# EAGLE schematic Displayboard_schematic (EAGLE 9.7.0)
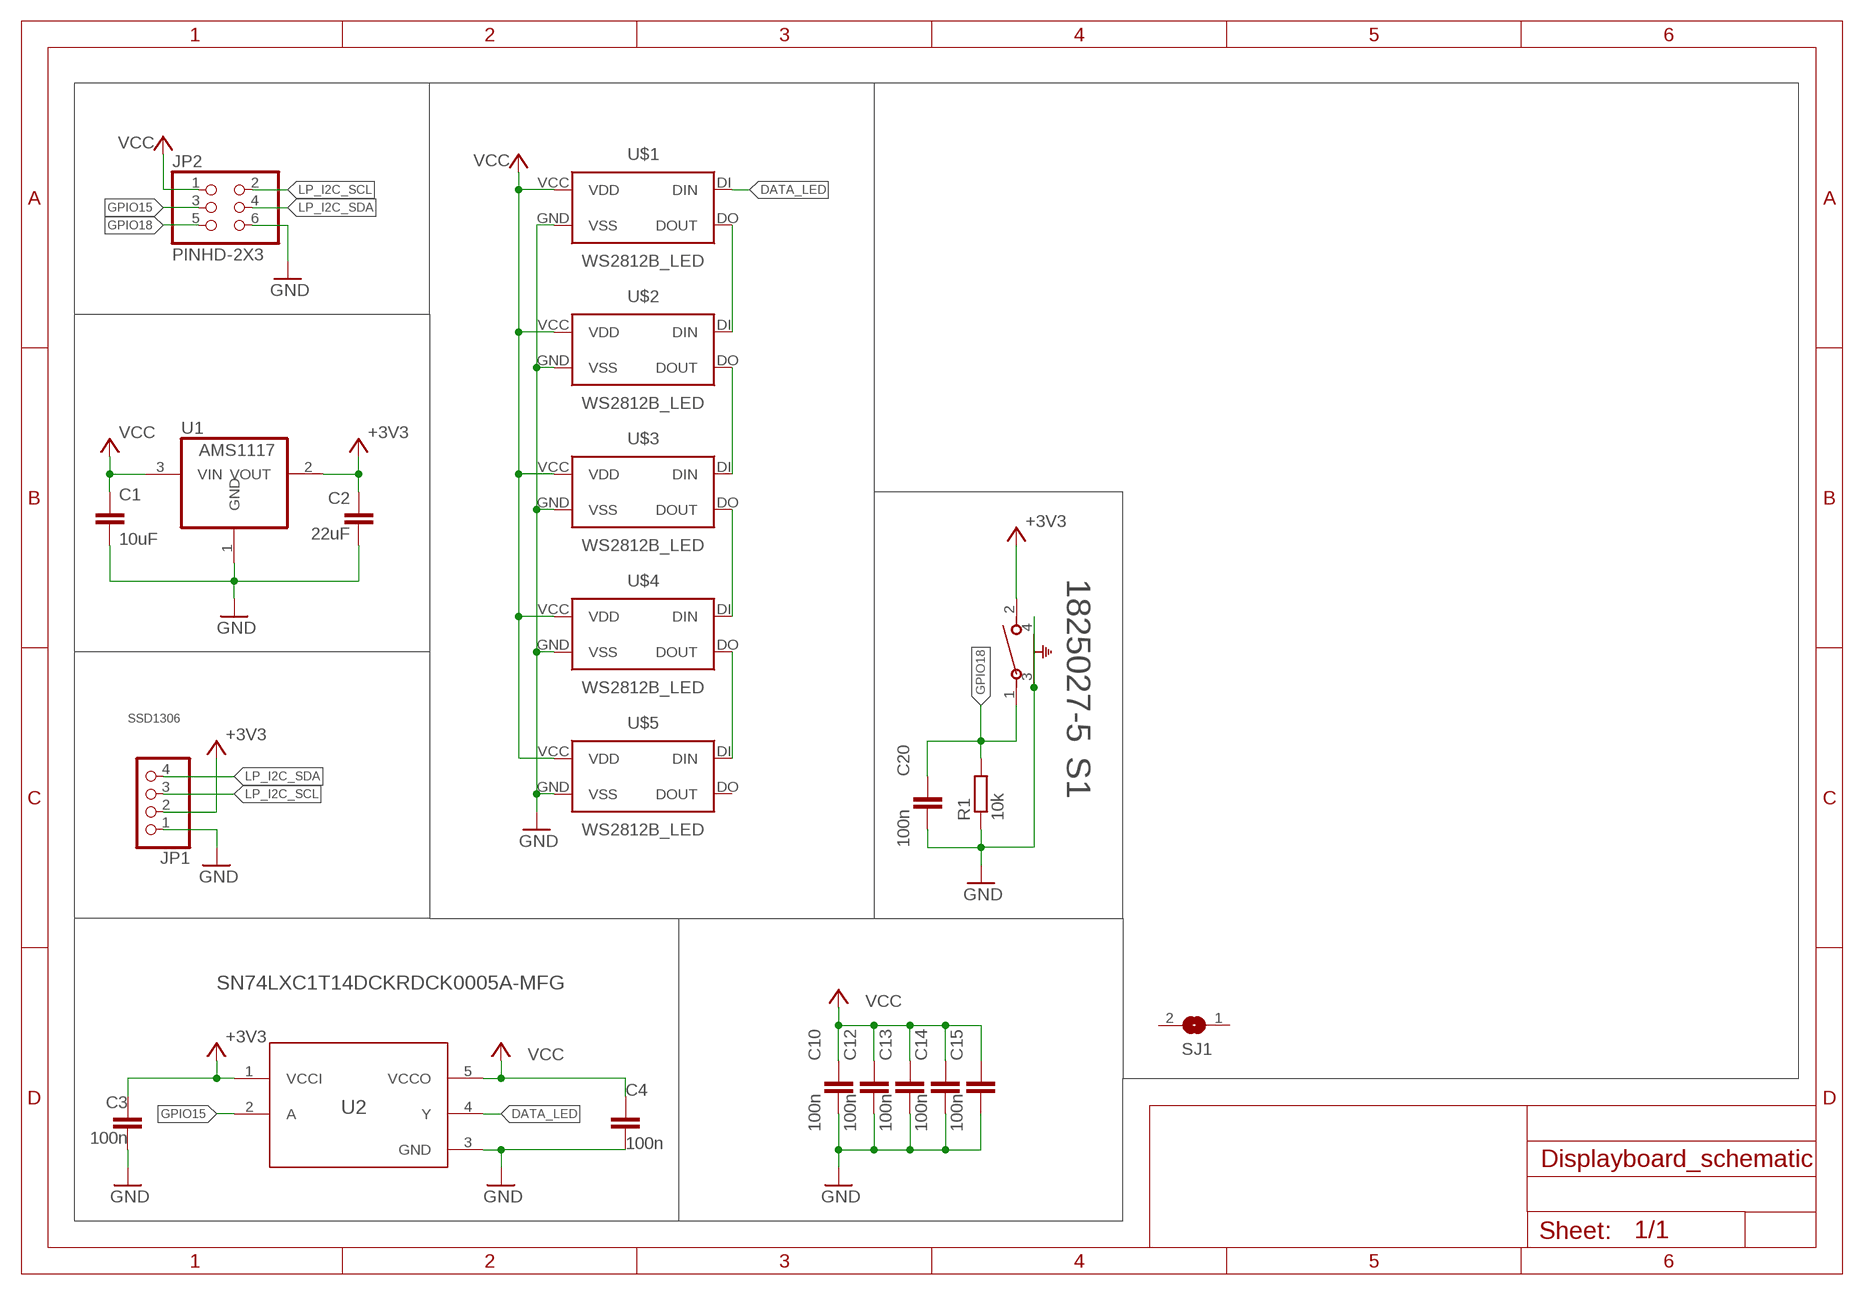
[diagram p0: schematic, sheet 1]

## Parts
C1  10uF  C-EUC0603  [C0603]
C2  22uF  C-EUC0603  [C0603]
C3  100n  C-EUC0603  [C0603]
C4  100n  C-EUC0603  [C0603]
C10  100n  C-EUC0603  [C0603]
C12  100n  C-EUC0603  [C0603]
C13  100n  C-EUC0603  [C0603]
C14  100n  C-EUC0603  [C0603]
C15  100n  C-EUC0603  [C0603]
C20  100n  C-EUC0603  [C0603]
JP1  PINHD-1X4  [1X04]
JP2  PINHD-2X3  [2X03]
R1  10k  R-EU_R0603  [R0603]
S1  1825027-5  [SW2_1825027-A]
SJ1  SJ  [SJ]
U1  AMS1117  LD1117  [SOT223]
U2  SN74LXC1T14DCKRDCK0005A-MFG  [DCK0005A-MFG]
U$1  WS2812B_LED  [WS2812_5050]
U$2  WS2812B_LED  [WS2812_5050]
U$3  WS2812B_LED  [WS2812_5050]
U$4  WS2812B_LED  [WS2812_5050]
U$5  WS2812B_LED  [WS2812_5050]

## Nets
+3V3: C2.1 C3.1 JP1.2 S1.2 U1.2(VOUT) U2.1(VCCI)
DATA_LED: U2.4(Y) U$1.DI(DIN)
GND: C1.2 C2.2 C3.2 C4.2 C10.2 C12.2 C13.2 C14.2 C15.2 C20.2 JP1.1 JP2.6 R1.1 S1.3 S1.4 U1.1(GND) U2.3(GND) U$1.GND(VSS) U$2.GND(VSS) U$3.GND(VSS) U$4.GND(VSS) U$5.GND(VSS)
GPIO15: JP2.3 U2.2(A)
GPIO18: C20.1 JP2.5 R1.2 S1.1
LP_I2C_SCL: JP1.3 JP2.2
LP_I2C_SDA: JP1.4 JP2.4
N$1: U$1.DO(DOUT) U$2.DI(DIN)
N$2: U$2.DO(DOUT) U$3.DI(DIN)
N$3: U$3.DO(DOUT) U$4.DI(DIN)
N$4: U$4.DO(DOUT) U$5.DI(DIN)
VCC: C1.1 C4.1 C10.1 C12.1 C13.1 C14.1 C15.1 JP2.1 U1.3(VIN) U2.5(VCCO) U$1.VCC(VDD) U$2.VCC(VDD) U$3.VCC(VDD) U$4.VCC(VDD) U$5.VCC(VDD)
Unconnected: SJ1.1 SJ1.2 U$5.DO(DOUT)

## Notes on the sheet
- SSD1306

## Library data of the parts
C1-C4 C10 C12-C15 C20 = rcl:C-EU: CAPACITOR, European symbol; SPICEPREFIX: C
JP1 = pinhead:PINHD-1X4: PIN HEADER
JP2 = Connector:PINHD-2X3: PIN HEADER; CATEGORY: Headers; DESCRIPTION: Header, Straight, 2x3 Position; MANUFACTURER: Generic; MPN: Generic; OPERATING_TEMPERATURE: Generic; PART_STATUS: Active; PITCH: 0.100" (2.54mm); ROHS_COMPLIANCE: Generic; SERIES: Generic; SUB-CATEGORY: Headers, Male Pins; TYPE: Board to Board or Cable, Unshrouded, Through Hole, Straight
R1 = rcl:R-EU_: RESISTOR, European symbol; SPICEPREFIX: R
S1 = Switches:1825027-5; BUILT_BY: EMA_UL_Team; CATEGORY: Tactile Switches; CONFIGURATION__POLE-THROW_: Single Pole - Single Throw; CONTACT_CURRENT_RATING: 50; COPYRIGHT: Copyright (C) 2016 Accelerated Designs. All rights reserved; DESCRIPTION: FSMRA2JH04=R/A,TACT PB SW,160G; MANUFACTURER_PART_NUMBER: 1825027-5; MAX_SWITCHING_CURRENT: -; MAX_SWITCHING_VOLTAGE_AC_: -; PART_STATUS: active; PRODUCT_TYPE: Switch; SERIES: Unknown; SWITCH_TYPE: Tactile Switches; TE_INTERNAL_NUMBER: 1825027-5; TE_PART_NUMBER: 1825027-5; VENDOR: TE Connectivity; VOLTAGE_RATING: -
SJ1 = jumper:SJ: SMD solder JUMPER
U1 = PulseOximeterECG_AU:LD1117: 800mA and 1A Low Dropout (LDO) Positive Regulator 1.8V, 2.5V, 2.85V, 3.3V, 5V, and Adj; MF: TEXAS INSTRUMENTS; MPN: REG1117FAKTTT; OC_FARNELL: 1296120; OC_NEWARK: 87H2562
U2 = 2024-05-29_22-22-57_Library:SN74LXC1T14DCKR; COPYRIGHT: Copyright (C) 2024 Ultra Librarian. All rights reserved.; MANUFACTURER_PART_NUMBER: SN74LXC1T14DCKR; MFR_NAME: Texas Instruments; REFDES: RefDes; TYPE: TYPE
U$1-U$5 = hbli8971:WS2812B_LED